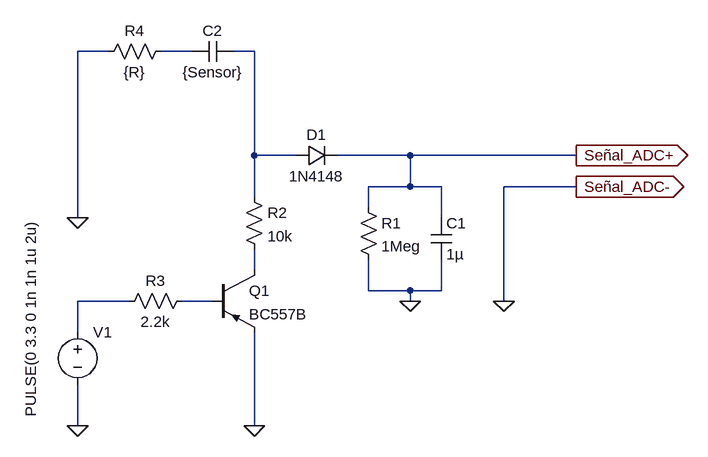
[diagram p0: schematic Practica_transistor.asc]
Practica_transistor.asc, the LTspice schematic file:
Version 4
SHEET 1 964 680
WIRE -64 -144 -112 -144
WIRE 64 -144 16 -144
WIRE 160 -144 128 -144
WIRE 160 16 160 -144
WIRE 224 16 160 16
WIRE 400 16 288 16
WIRE 656 16 400 16
WIRE 400 64 400 16
WIRE 400 64 336 64
WIRE 448 64 400 64
WIRE 656 64 544 64
WIRE 160 80 160 16
WIRE 336 96 336 64
WIRE -112 112 -112 -144
WIRE 448 112 448 64
WIRE 160 192 160 160
WIRE 336 224 336 176
WIRE 400 224 336 224
WIRE 448 224 448 176
WIRE 448 224 400 224
WIRE -32 240 -112 240
WIRE 96 240 48 240
WIRE 400 240 400 224
WIRE 544 240 544 64
WIRE -112 288 -112 240
WIRE -112 432 -112 368
WIRE 160 432 160 288
FLAG 400 240 0
FLAG 160 432 0
FLAG -112 112 0
FLAG -112 432 0
FLAG 544 240 0
FLAG 656 16 Señal_ADC+
IOPIN 656 16 Out
FLAG 656 64 Señal_ADC-
IOPIN 656 64 Out
SYMBOL res 320 80 R0
SYMATTR InstName R1
SYMATTR Value 1Meg
SYMBOL cap 432 112 R0
SYMATTR InstName C1
SYMATTR Value 1µ
SYMBOL diode 224 0 M90
WINDOW 0 0 32 VBottom 2
WINDOW 3 32 32 VTop 2
SYMATTR InstName D1
SYMATTR Value 1N4148
SYMBOL res 144 64 R0
SYMATTR InstName R2
SYMATTR Value 10k
SYMBOL pnp 96 192 R0
SYMATTR InstName Q1
SYMATTR Value BC557B
SYMBOL res 64 224 R90
WINDOW 0 0 56 VBottom 2
WINDOW 3 32 56 VTop 2
SYMATTR InstName R3
SYMATTR Value 2.2k
SYMBOL voltage -112 272 R0
WINDOW 3 -72 -157 VRight 2
WINDOW 123 0 0 Left 0
WINDOW 39 0 0 Left 0
SYMATTR Value PULSE(0 3.3 0 1n 1n 1u 2u)
SYMATTR InstName V1
SYMBOL res 32 -160 R90
WINDOW 0 0 56 VBottom 2
WINDOW 3 32 56 VTop 2
SYMATTR InstName R4
SYMATTR Value {R}
SYMBOL cap 128 -160 R90
WINDOW 0 0 32 VBottom 2
WINDOW 3 32 32 VTop 2
SYMATTR InstName C2
SYMATTR Value {Sensor}

The netlist it stands for:
* Practica_transistor.asc
R1 Señal_ADC+ 0 1Meg
C1 Señal_ADC+ 0 1µ
D1 N002 Señal_ADC+ 1N4148
R2 N002 N003 10k
Q1 N003 N005 0 0 BC557B
R3 N005 N004 2.2k
V1 N004 0 PULSE(0 3.3 0 1n 1n 1u 2u)
R4 N001 0 {R}
C2 N002 N001 {Sensor}
.model D D
.lib standard.dio
.model NPN NPN
.model PNP PNP
.lib standard.bjt
.backanno
.end